# Altium schematic sheet MCU.SchDoc
size 558 x 431 mm; SheetNumber: 2; SheetTotal: 2
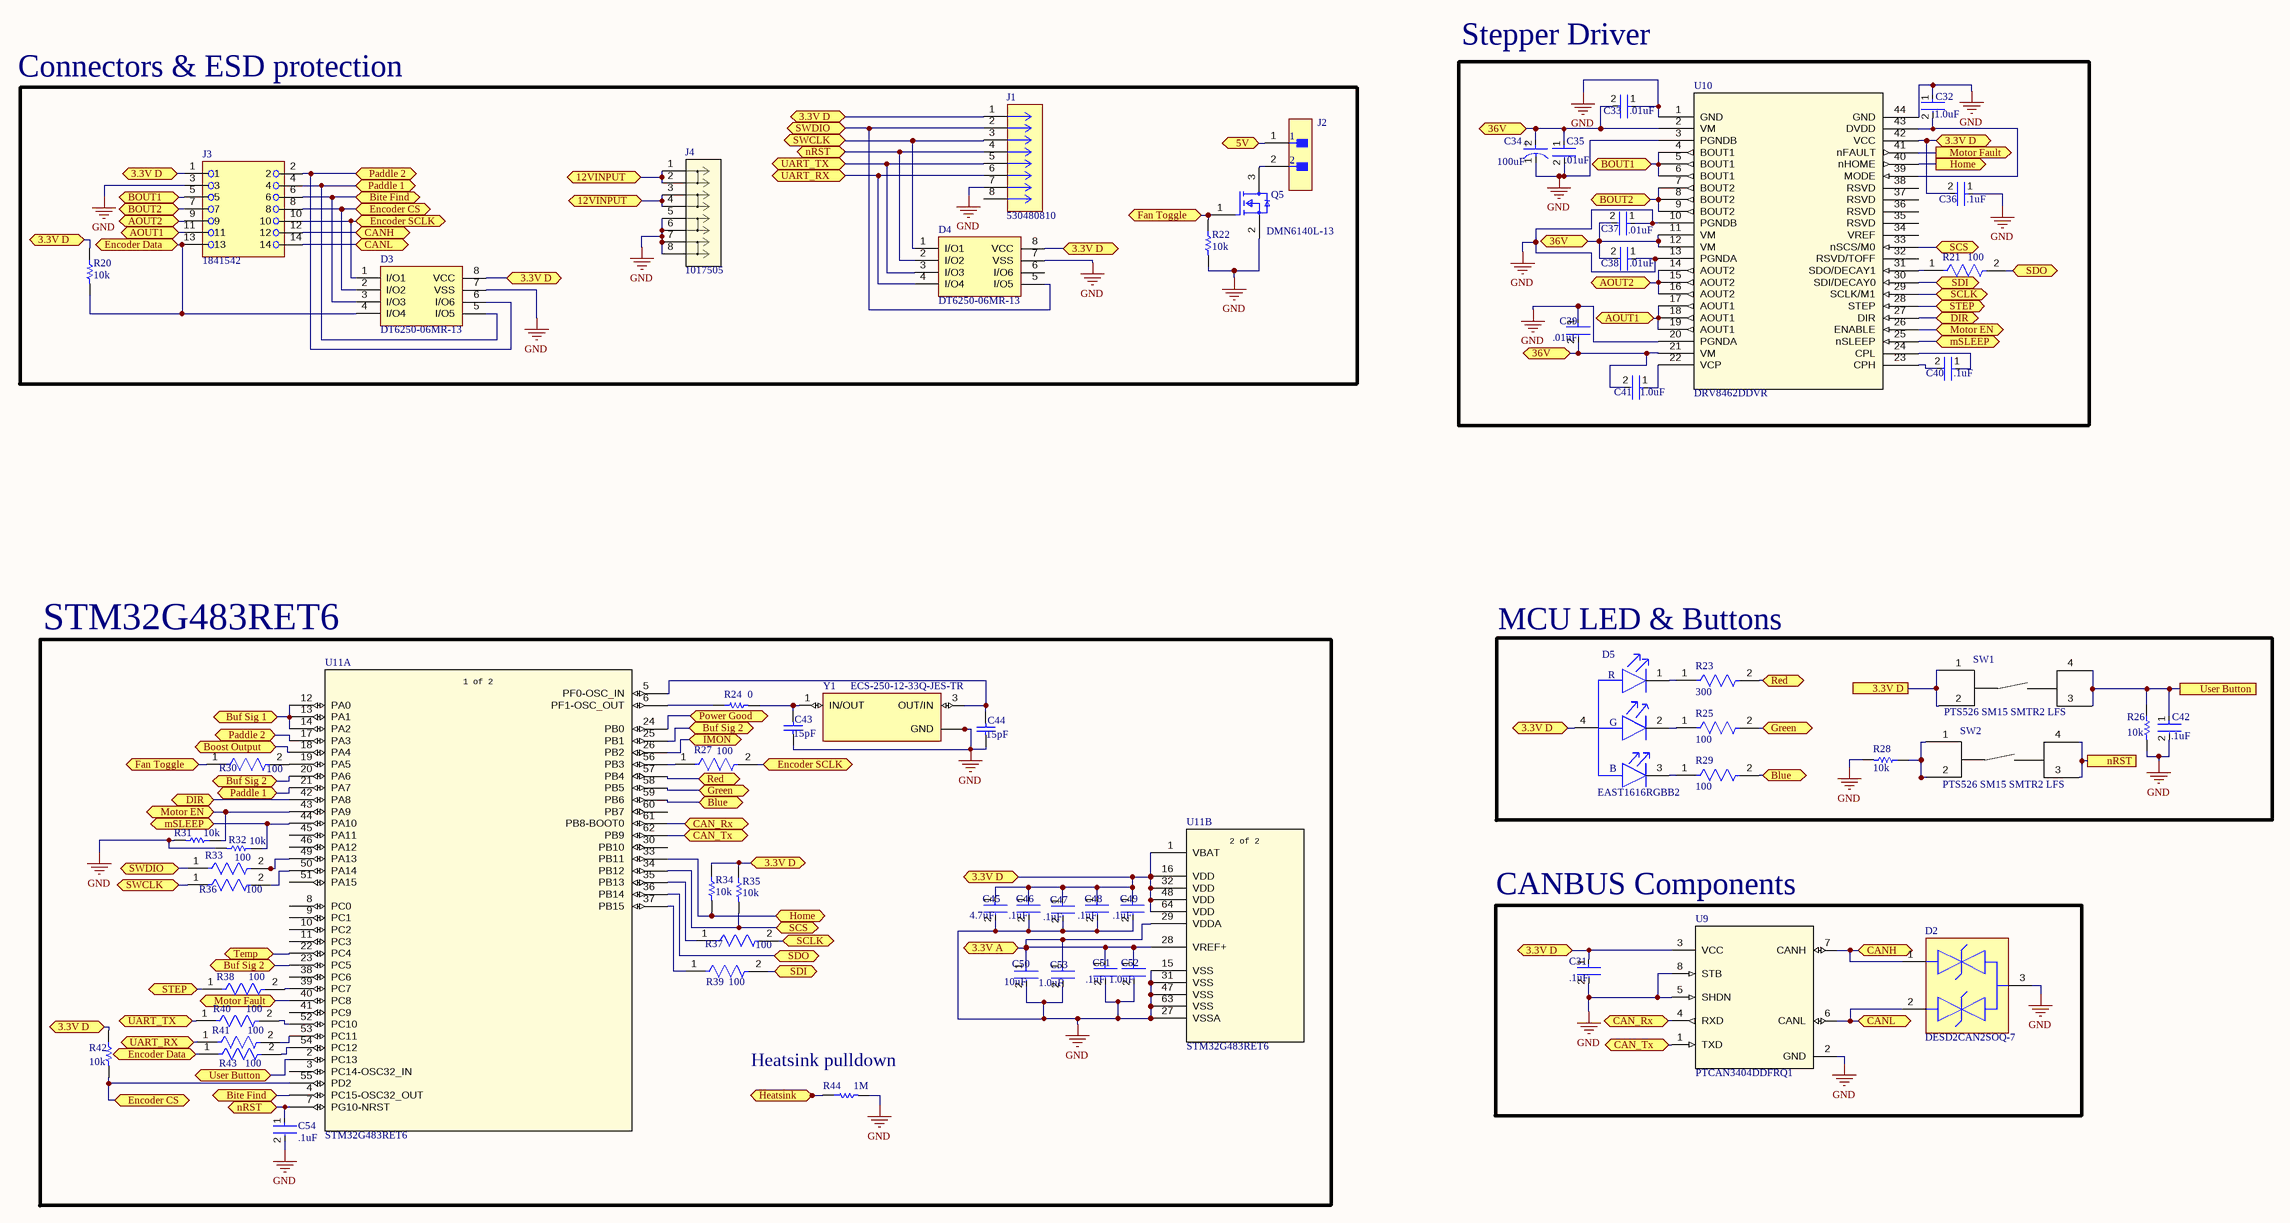
[diagram p0: MCU.SchDoc]

## Parts
C31  .1uF  [FP-GRM155-0_05-MFG]
C32  1.0uF  [FP-GRM155-0_1-MFG]
C33  .01uF  [FP-CGA2B-IPC_C]
C34  100uF  [FP-FKF-MFG]
C35  .01uF  [FP-CGA2B-IPC_C]
C36  .1uF  [FP-GRM155-0_05-MFG]
C37  .01uF  [FP-CGA2B-IPC_C]
C38  .01uF  [FP-CGA2B-IPC_C]
C39  .01uF  [FP-CGA2B-IPC_C]
C40  .1uF  [FP-GRM155-0_05-MFG]
C41  1.0uF  [FP-GRM155-0_1-MFG]
C42  .1uF  [FP-GRM155-0_05-MFG]
C43  15pF  [CAPC2013X94X50LL20T25]
C44  15pF  [CAPC2013X94X50LL20T25]
C45  4.7uF  [FP-CL829-IPC_C]
C46  .1uF  [FP-GRM155-0_05-MFG]
C47  .1uF  [FP-GRM155-0_05-MFG]
C48  .1uF  [FP-GRM155-0_05-MFG]
C49  .1uF  [FP-GRM155-0_05-MFG]
C50  10uF  [FP-CL21-IPC_A]
C51  .1uF  [FP-GRM155-0_05-MFG]
C52  1.0uF  [FP-GRM155-0_1-MFG]
C53  1.0uF  [FP-GRM155-0_1-MFG]
C54  .1uF  [FP-GRM155-0_05-MFG]
D2  DESD2CAN2SOQ-7  [FP-SOT23-MFG]
D3  DT6250-06MR-13  [SOP65P490X110-8N]
D4  DT6250-06MR-13  [SOP65P490X110-8N]
D5  EAST1616RGBB2  [FP-EAST1616RGBB2-MFG]
J1  530480810  [CONN08_530480810_MOL]
J2  B2B-ZR-3.4(LF)(SN)  [FP-B2B-ZR-3_4_LF_SN-MFG]  (value not drawn)
J3  1841542  [PHOENIX_1841542]
J4  1017505  [CONN_1017493]
Q5  DMN6140L-13  [FP-SOT23-MFG]
R20  10k  [RESC1005X40X25ML05T10]
R21  100  [FP-RT0402-MFG]
R22  10k  [RESC1005X40X25ML05T10]
R23  300  [FP-ERJ2RK-IPC_A]
R24  0  [RESC1005X40X25NL05T10]
R25  100  [FP-RT0402-MFG]
R26  10k  [RESC1005X40X25ML05T10]
R27  100  [FP-RT0402-MFG]
R28  10k  [RESC1005X40X25ML05T10]
R29  100  [FP-RT0402-MFG]
R30  100  [FP-RT0402-MFG]
R31  10k  [RESC1005X40X25ML05T10]
R32  10k  [RESC1005X40X25ML05T10]
R33  100  [FP-RT0402-MFG]
R34  10k  [RESC1005X40X25ML05T10]
R35  10k  [RESC1005X40X25ML05T10]
R36  100  [FP-RT0402-MFG]
R37  100  [FP-RT0402-MFG]
R38  100  [FP-RT0402-MFG]
R39  100  [FP-RT0402-MFG]
R40  100  [FP-RT0402-MFG]
R41  100  [FP-RT0402-MFG]
R42  10k  [RESC1005X40X25ML05T10]
R43  100  [FP-RT0402-MFG]
R44  1M  [RESC0603X26X15NL03T05]
SW1  PTS526 SM15 SMTR2 LFS  [SON4_PTS526 SM15 SMTR2 LFS_CNK]
SW2  PTS526 SM15 SMTR2 LFS  [SON4_PTS526 SM15 SMTR2 LFS_CNK]
U9  PTCAN3404DDFRQ1  [DDF0008A-IPC_A]
U10  DRV8462DDVR  [HTSSOP44_DDV_TEX]
U11  STM32G483RET6  [LQFP64-10x10mm_STM]  (parts A,B of 2)
Y1  ECS-250-12-33Q-JES-TR  [XTAL_ECS-250-12-33Q-JES-TR]

## Blocks framed on the sheet
Connectors & ESD protection: D3 D4 J1-J4 Q5 R20 R22
Stepper Driver: C32-C41 R21 U10
STM32G483RET6: C43-C54 R24 R27 R30-R44 U11 Y1
MCU LED & Buttons: C42 D5 R23 R25 R26 R28 R29 SW1 SW2
CANBUS Components: C31 D2 U9

## Ports
3.3V A (bidir, see Power_Supplies[5C]), 3.3V D (bidir, see MCU[3D], MCU[3G], MCU[4C], MCU[4D], MCU[6D], MCU[6F], MCU[7D], MCU[7G], MCU[8F], MCU[10C], MCU[10F], Power_Supplies[5C]), 3.3V D (bidir, see MCU[3D], MCU[3G], MCU[4C], MCU[4D], MCU[6D], MCU[6F], MCU[7D], MCU[7G], MCU[8F], MCU[10F], Power_Supplies[5C]), 3.3V D (bidir, see MCU[3D], MCU[3G], MCU[4C], MCU[4D], MCU[6D], MCU[6F], MCU[7D], MCU[7G], MCU[10C], MCU[10F], Power_Supplies[5C]), 3.3V D (bidir, see MCU[3D], MCU[3G], MCU[4C], MCU[4D], MCU[6D], MCU[6F], MCU[7D], MCU[8F], MCU[10C], MCU[10F], Power_Supplies[5C]), 3.3V D (bidir, see MCU[3D], MCU[3G], MCU[4C], MCU[4D], MCU[6D], MCU[6F], MCU[7G], MCU[8F], MCU[10C], MCU[10F], Power_Supplies[5C]), 3.3V D (bidir, see MCU[3D], MCU[3G], MCU[4C], MCU[4D], MCU[6D], MCU[7D], MCU[7G], MCU[8F], MCU[10C], MCU[10F], Power_Supplies[5C]), 3.3V D (bidir, see MCU[3D], MCU[3G], MCU[4C], MCU[4D], MCU[6F], MCU[7D], MCU[7G], MCU[8F], MCU[10C], MCU[10F], Power_Supplies[5C]), 3.3V D (bidir, see MCU[3D], MCU[3G], MCU[4C], MCU[6D], MCU[6F], MCU[7D], MCU[7G], MCU[8F], MCU[10C], MCU[10F], Power_Supplies[5C]), 3.3V D (bidir, see MCU[3D], MCU[3G], MCU[4D], MCU[6D], MCU[6F], MCU[7D], MCU[7G], MCU[8F], MCU[10C], MCU[10F], Power_Supplies[5C]), 3.3V D (bidir, see MCU[3D], MCU[4C], MCU[4D], MCU[6D], MCU[6F], MCU[7D], MCU[7G], MCU[8F], MCU[10C], MCU[10F], Power_Supplies[5C]), 3.3V D (see MCU[3G], MCU[4C], MCU[4D], MCU[6D], MCU[6F], MCU[7D], MCU[7G], MCU[8F], MCU[10C], MCU[10F], Power_Supplies[5C]), 5V (bidir, see Power_Supplies[4C]), 12VINPUT (bidir, see MCU[8F], Power_Supplies[2B]), 36V (bidir, see MCU[4F], MCU[4G], Power_Supplies[6D]), 36V (bidir, see MCU[4F], Power_Supplies[6D]), AOUT1 (bidir, see MCU[4F]), AOUT1 (bidir, see MCU[10F]), AOUT2 (bidir, see MCU[4F]), AOUT2 (bidir, see MCU[10F]), Bite Find (bidir, see MCU[9C]), Bite Find (bidir, see MCU[9F]), Blue (bidir, see MCU[3D]), Blue (bidir, see MCU[7D]), Boost Output (bidir, see Power_Supplies[4E]), BOUT1 (bidir, see MCU[4G]), BOUT1 (bidir, see MCU[10F]), BOUT2 (bidir, see MCU[4F]), BOUT2 (bidir, see MCU[10F]), Buf Sig 1 (bidir), Buf Sig 2 (bidir, see MCU[7D], MCU[9C]), Buf Sig 2 (bidir, see MCU[7D], MCU[9D]), Buf Sig 2 (bidir, see MCU[9C], MCU[9D]), CAN_Rx (bidir, see MCU[4C]), CAN_Rx (bidir, see MCU[7D]), CAN_Tx (bidir, see MCU[4C]), CAN_Tx (bidir, see MCU[7D]), CANH (bidir, see MCU[3C]), CANH (bidir, see MCU[9F]), CANL (bidir, see MCU[3C]), CANL (bidir, see MCU[9F]), DIR (bidir, see MCU[3F]), DIR (bidir, see MCU[9D]), Encoder CS (bidir, see MCU[9F]), Encoder CS (bidir, see MCU[10C]), Encoder Data (bidir, see MCU[10C]), Encoder Data (bidir, see MCU[10F]), Encoder SCLK (bidir, see MCU[7D]), Encoder SCLK (bidir, see MCU[9F]), Fan Toggle (bidir, see MCU[6F]), Fan Toggle (bidir, see MCU[10D]), Green (bidir, see MCU[3D]), Green (bidir, see MCU[7D]), Heatsink (bidir), Home (bidir, see MCU[3G]), Home (out, see MCU[7D]), IMON (bidir, see Power_Supplies[6B]), Motor EN (bidir, see MCU[3F]), Motor EN (bidir, see MCU[9D]), Motor Fault (bidir, see MCU[3G]), Motor Fault (out, see MCU[9C]), mSLEEP (bidir, see MCU[3F]), mSLEEP (bidir, see MCU[9D]), nRST (bidir, see MCU[2D], MCU[7G]), nRST (bidir, see MCU[2D], MCU[9C]), nRST (see MCU[7G], MCU[9C]), Paddle 1 (bidir, see MCU[9D]), Paddle 1 (bidir, see MCU[9F]), Paddle 2 (bidir, see MCU[9D]), Paddle 2 (bidir, see MCU[9F]), Power Good (bidir, see Power_Supplies[4D]), Red (bidir, see MCU[3D]), Red (bidir, see MCU[7D]), SCLK (bidir, see MCU[3F]), SCLK (bidir, see MCU[7C]), SCS (bidir, see MCU[3F]), SCS (bidir, see MCU[7C]), SDI (bidir, see MCU[3F]), SDI (bidir, see MCU[7C]), SDO (bidir, see MCU[2F]), SDO (bidir, see MCU[7C]), STEP (bidir, see MCU[3F]), STEP (bidir, see MCU[9C]), SWCLK (bidir, see MCU[7G]), SWCLK (bidir, see MCU[10D]), SWDIO (bidir, see MCU[7G]), SWDIO (bidir, see MCU[10D]), Temp (bidir, see Power_Supplies[4B]), UART_RX (bidir, see MCU[7F]), UART_RX (bidir, see MCU[10C]), UART_TX (bidir, see MCU[7G]), UART_TX (bidir, see MCU[10C]), User Button (bidir, see MCU[2D]), User Button (see MCU[9C])

## Nets
GND: C31.2 C32.1 C33.1 C34.1(C) C35.2 C36.1 C37.1 C38.1 C39.1 C42.2 C43.2 C44.2 C45.2 C46.2 C47.2 C48.2 C49.2 C50.2 C51.2 C52.2 C53.2 C54.2 D2.3 D3.7(VSS) D4.7(VSS) J1.7 J3.3 J4.5 J4.6 J4.7 J4.8 Q5.2(S) R22.2 R26.2 R28.2 R31.2 R32.2 R44.2 U9.2(GND) U9.5(SHDN) U9.8(STB) U10.1(GND) U10.3(PGNDB) U10.10(PGNDB) U10.13(PGNDA) U10.20(PGNDA) U10.44(GND) U11.15(VSS) U11.27(VSSA) U11.31(VSS) U11.47(VSS) U11.63(VSS) Y1.2(GND) Y1.4(GND)
3.3V A: C50.1 C51.1 C52.1 C53.1 U11.28(VREF+) U11.29(VDDA) ; port 3.3V A
3.3V D: C31.1 C36.2 C45.1 C46.1 C47.1 C48.1 C49.1 D3.8(VCC) D4.8(VCC) D5.4(Common_Anode) J1.1 J3.1 R20.1 R34.1 R35.1 R42.1 SW1.1 SW1.2 U9.3(VCC) U10.42(VCC) U11.1(VBAT) U11.16(VDD) U11.32(VDD) U11.48(VDD) U11.64(VDD) ; port 3.3V D
5V: J2.1 ; port 5V
12VINPUT: J4.1 J4.2 J4.3 J4.4 ; port 12VINPUT
36V: C33.2 C34.2(A) C35.1 C37.2 C38.2 C39.2 C41.2 U10.2(VM) U10.11(VM) U10.12(VM) U10.21(VM) ; port 36V
AOUT1: J3.11 U10.17(AOUT1) U10.18(AOUT1) U10.19(AOUT1) ; port AOUT1
AOUT2: J3.9 U10.14(AOUT2) U10.15(AOUT2) U10.16(AOUT2) ; port AOUT2
Bite Find: D3.3(I/O3) J3.6 U11.4(PC15-OSC32_OUT) ; port Bite Find
Blue: R29.2 U11.59(PB6) ; port Blue
Boost Output: U11.18(PA4) ; port Boost Output
BOUT1: J3.5 U10.4(BOUT1) U10.5(BOUT1) U10.6(BOUT1) ; port BOUT1
BOUT2: J3.7 U10.7(BOUT2) U10.8(BOUT2) U10.9(BOUT2) ; port BOUT2
Buf Sig 1: U11.12(PA0) U11.13(PA1) U11.14(PA2) ; port Buf Sig 1
Buf Sig 2: U11.20(PA6) U11.23(PC5) U11.25(PB1) ; port Buf Sig 2
CAN_Rx: U9.4(RXD) U11.61(PB8-BOOT0) ; port CAN_Rx
CAN_Tx: U9.1(TXD) U11.62(PB9) ; port CAN_Tx
CANH: D2.1 J3.12 U9.7(CANH) ; port CANH
CANL: D2.2 J3.14 U9.6(CANL) ; port CANL
DIR: U10.27(DIR) U11.42(PA8) ; port DIR
Encoder CS: D3.2(I/O2) J3.8 R42.2 U11.55(PD2) ; port Encoder CS
Encoder Data: D3.4(I/O4) J3.13 R20.2 R43.1 ; port Encoder Data
Encoder SCLK: D3.1(I/O1) J3.10 R27.2 ; port Encoder SCLK
Fan Toggle: Q5.1(G) R22.1 R30.1 ; port Fan Toggle
Green: R25.2 U11.58(PB5) ; port Green
Heatsink: R44.1 ; port Heatsink
Home: R34.2 U10.40(nHOME) U11.33(PB11) ; port Home
IMON: U11.26(PB2) ; port IMON
Motor EN: R31.1 U10.26(ENABLE) U11.43(PA9) ; port Motor EN
Motor Fault: U10.41(nFAULT) U11.40(PC8) ; port Motor Fault
mSLEEP: R32.1 U10.25(nSLEEP) U11.44(PA10) ; port mSLEEP
nRST: C54.1 D4.2(I/O2) J1.4 SW2.3 SW2.4 U11.7(PG10-NRST) ; port nRST
Paddle 1: D3.5(I/O5) J3.4 U11.21(PA7) ; port Paddle 1
Paddle 2: D3.6(I/O6) J3.2 U11.17(PA3) ; port Paddle 2
Power Good: U11.24(PB0) ; port Power Good
Red: R23.2 U11.57(PB4) ; port Red
SCLK: R37.2 U10.29(SCLK/M1) ; port SCLK
SCS: R35.2 U10.33(nSCS/M0) U11.34(PB12) ; port SCS
SDI: R39.2 U10.30(SDI/DECAY0) ; port SDI
SDO: R21.2 U11.36(PB14) ; port SDO
STEP: R38.1 U10.28(STEP) ; port STEP
SWCLK: D4.1(I/O1) J1.3 R36.1 ; port SWCLK
SWDIO: D4.5(I/O5) J1.2 R33.1 ; port SWDIO
Temp: U11.22(PC4) ; port Temp
UART_RX: D4.4(I/O4) J1.6 R41.1 ; port UART_RX
UART_TX: D4.3(I/O3) J1.5 R40.1 ; port UART_TX
User Button: C42.1 R26.1 SW1.3 SW1.4 U11.2(PC13) ; port User Button
NetC32_2: C32.2 U10.39(MODE) U10.43(DVDD)
NetC40_1: C40.1 U10.24(CPL)
NetC40_2: C40.2 U10.23(CPH)
NetC41_1: C41.1 U10.22(VCP)
NetC43_1: C43.1 R24.2 Y1.1(IN/OUT)
NetC44_1: C44.1 U11.5(PF0-OSC_IN) Y1.3(OUT/IN)
NetD5_1: D5.1(Red_C) R23.1
NetD5_2: D5.2(Green_C) R25.1
NetD5_3: D5.3(Blue_C) R29.1
NetJ2_2: J2.2 Q5.3(D)
NetR21_1: R21.1 U10.31(SDO/DECAY1)
NetR24_1: R24.1 U11.6(PF1-OSC_OUT)
NetR27_1: R27.1 U11.56(PB3)
NetR28_1: R28.1 SW2.1 SW2.2
NetR30_2: R30.2 U11.19(PA5)
NetR33_2: R33.2 U11.49(PA13)
NetR36_2: R36.2 U11.50(PA14)
NetR37_1: R37.1 U11.35(PB13)
NetR38_2: R38.2 U11.39(PC7)
NetR39_1: R39.1 U11.37(PB15)
NetR40_2: R40.2 U11.52(PC10)
NetR41_2: R41.2 U11.53(PC11)
NetR43_2: R43.2 U11.54(PC12)

Not connected (* = marked no-connect by the designer): D4 6(I/O6); J1 8; U10 32(RSVD/TOFF) 34(VREF) 35(RSVD) 36(RSVD) 37(RSVD) 38(RSVD); U11 3(PC14-OSC32_IN) 8(PC0) 9(PC1) 10(PC2) 11(PC3) 30(PB10) 38(PC6) 41(PC9) 45(PA11) 46(PA12) 51(PA15) 60(PB7)

## Notes on the sheet
- (near R44) Heatsink pulldown
- DWG. NO.
- REV.
- SHT.
- REVISION
- DESCRIPTION
- DATE
- APPROVED
- THIS DOCUMENT AND THE DATA DISCLOSED HEREIN OR HEREWITH IS THE PROPERTY OF ALTIUM LIMITED AND MAY BE FREELY DISTRIBUTED IN WHOLE. NO RIGHTS ARE RESERVED OR EXPRESS OR IMPLIED WARANTEE GIVEN.
- ENG:
- DSN:
- APPROVALS
- PROJECT
- DOCUMENT REVISION:
- DESIGN ITEM:
- CHK:
- BOM:
- REFERENCE DOCUMENTS
- PROJECT REVISION:
- TITLE
- FAB DWG:
- PCB DWG:
- ASSY DWG:
- SCALE:
- SIZE
- C
- CAGE CODE
- FILE NAME
- DWG NO.
- SHEET
- OF
- REV
- (in symbol CMP-031-00013-2, part A) 1 of 2
- (in symbol CMP-031-00013-2, part B) 2 of 2
- (in symbol CMP-2000-06208-3) +
- (in symbol CMP-51564-000002-1) R; G; B

## Library data of the parts
C31 C36 C40 C42 C46-C49 C51 C54 = CMP-06035-023139-1: Chip Multilayer Ceramic Capacitors for General Purpose, 0402, 0.10uF, B, 10%, 10%, 50V; Capacitance: 100nF; Value: 100nF; Length: 1mm; Width: 500um; Voltage Rating (DC): 50V; Lead Free: Lead Free; Tolerance: 10%; Thickness: 500um
C32 C41 C52 C53 = CMP-06035-041084-1: Chip Multilayer Ceramic Capacitors for General Purpose, 0402, 1.0uF, X5R, 15%, 10%, 50V
C33 C35 C37-C39 = CMP-08246-000752-1: Cap Ceramic 10nF 50V X7R 20% Pad SMD 0402 +125°C Automotive T/R; Voltage Rating (DC): 50V; Dielectric: X7R; Length: 0.039inch; Weight: 2.3E-05oz; Mount: Surface Mount; Thickness: 0.022inch; Height: 0.5mm; Voltage Rating: 50V; Max Operating Temperature: 125°C; Case Code (Imperial): 0402; Capacitance: 10nF; Min Operating Temperature: -55°C; Case Code (Metric): 1005; Case/Package: 0402; Tolerance: 20%; Package Quantity: 10000; Width: 0.02inch; Packaging: Tape and Reel; Ratings: AEC-Q200; Value: 10nF
C34 = CMP-2000-06208-3: Radial Can - SMD ALUMINUM ELECTROLYTIC CAPACITOR FK 50V 100muF ±20% 0.315Dia 8.00mm; Leakage Current: 3uA; ESR (Equivalent Series Resistance): 340mR; Material: Aluminium; Ripple Current: 350mA; Life (Hours): 2000Hour; Min Operating Temperature: -55°C; Contact Plating: Tin; REACH SVHC: No SVHC; RoHS Compliant: Yes; Width: 10mm; Radiation Hardening: No; Termination: SMD/SMT; Packaging: Tape and Reel; Max Operating Temperature: 105°C; Case/Package: Radial; Voltage Rating: 50V; Length: 10.2mm; Voltage: 50V; Package Quantity: 1; Voltage Rating (DC): 50V; Height - Seated (Max): 0.402inch; Mount: Surface Mount; Impedance: 340mR; Construction: Cylindrical; Height: 10.2mm; Lead Free: Lead Free; Dielectric Material: Aluminium; Series: FK; Tolerance: 20%; Diameter: 8mm; Ripple Current (AC): 350mA; Capacitance: 100uF; Number of Pins: 2; Value: 100uF
C43 C44 = CMP-2007-04490-1: Cap Ceramic 15pF 50V C0G 1% SMD 0805 125°C Paper T/R; Part Number: 08055A150FAT2A; Manufacturer: AVX Interconnect / Elco
C45 = CMP-13271-001468-1: Cap Ceramic 4.7uF 16V X5R ±20% SMD 0402 +85°C Paper T/R; Mount: Surface Mount; Case Code (Metric): 1005; Case/Package: 0402; Length: 0.039inch; Capacitance: 4.7uF; Voltage Rating: 16V; Max Operating Temperature: 85°C; Tolerance: 20%; Thickness: 0.022inch; Min Operating Temperature: -55°C; Case Code (Imperial): 0402; Packaging: Tape and Reel; Width: 0.02inch; Value: 4.7uF
C50 = CMP-13271-002975-1: CL21 Series 0805 10uF 25V ±10% Tolerance X5R Multilayer Ceramic Chip Capacitor; Case Code (Imperial): 0805; Length: 2mm; Case/Package: 0805; Packaging: Tape and Reel; Width: 0.049inch; Tolerance: 10%; Mount: Surface Mount; Min Operating Temperature: -55°C; Thickness: 0.057inch; Height: 1.25mm; Dielectric: X5R; Package Quantity: 1; Depth: 1.25mm; Capacitance: 10uF; Voltage Rating: 25V; Case Code (Metric): 2012; Max Operating Temperature: 85°C; Radiation Hardening: No; Value: 10uF
D2 = CMP-12828-000016-1: TVS DIODE 24V 41V SOT23; Manufacturer: Diodes Inc.; Peak Pulse Current: 5A; Automotive Grade: Grade 0; Value: 25pF; Number Of Channels: 2; Direction: Bidirectional; Max Junction Temp: +150°C; Breakdown Voltage: 25.4V; Peak Pulse Power: 230W; Standoff Height: 0.013mm; ComponentLink2Description: Datasheet; Temperature Range High: +150°C; Device Class L2: TVS Diodes; Octopart: https://octopart.com/desd2can2soq-7-diodes+inc.-53081564; Device Class L3: unset; RoHS: TRUE; ComponentLink2URL: https://www.diodes.com/assets/Datasheets/DESD2CAN2SOQ.pdf; Height: 1.1mm; Digikey Description: TVS DIODE 24V 41V SOT23; Footprint Url: https://www.diodes.com/assets/Package-Files/SOT23.pdf; Manufacturer Part Number: DESD2CAN2SOQ-7; Package: SOT23; Temperature: -65°C to +150°C; Mouser Description: ESD Suppressors / TVS Diodes Dual CAN Bus ESD 25pF 24V 25.4V; Capacitance: 25pF; Category: Diode; Clamping Voltage: 41V; Lead Free: Yes; Reverse Standoff Voltage: 24V; Device Class L1: Circuit Protection; Temperature Range Low: -65°C; Automotive: Yes
D3 D4 = CMP-004-00033-2: ESD Suppressors / TVS Diodes TVS Low Cap ESD 0.32pF 5V 4A 10Vc; Manufacturer_Name: Diodes Incorporated; Geometry.Height: 1.1mm; Source: DT6250-06MR-13.SchLib; Mouser Price/Stock: https://www.mouser.co.uk/ProductDetail/Diodes-Incorporated/DT6250-06MR-13?qs=wtVJq%252Be05r%252BwT706hxu0BA%3D%3D; Mouser Part Number: 621-DT6250-06MR-13; Datasheet Link: https://www.diodes.com//assets/Datasheets/DT6250-06MR.pdf; Manufacturer_Part_Number: DT6250-06MR-13; Design Item ID: DT6250-06MR-13
D5 = CMP-51564-000002-1: LED RGB DIFFUSED 4SMD; Manufacturer: Everlight; Viewing Angle: 120°; Power Dissipation: 95/95/60mW; Luminous Intensity: 36/140/45mcd; Colour: Blue, Green, Red; Peak Emmision Wavelength: 468/518/632nm; Forward Current: 5mA; Reverse Voltage: 5V; Led Orientation: Top View; Forward Voltage: 3/3/2.1V; Wavelength: 475/535/628nm; Temperature: -40°C to +85°C; Temperature Range Low: -40°C; ComponentLink2URL: https://everlightamericas.com/index.php?controller=attachment&id_attachment=2426; ComponentLink2Description: Datasheet; Category: Diode; Digikey Description: LED RGB DIFFUSED 4SMD; Automotive: No; RoHS: TRUE; Manufacturer Part Number: EAST1616RGBB2; Device Class L2: LEDs; Device Class L1: Optoelectronics; Octopart: https://octopart.com/east1616rgbb2-everlight-80328051; Device Class L3: unset; Package: 0; Temperature Range High: +85°C; Lead Free: Yes; Height: 0.45mm
J1 = CMP-002-00077-2: Conn Shrouded Header (4 Sides) HDR 8 POS 1.25mm Solder RA Thru-Hole PicoBladeâ„¢ Tray; MF: Molex; Case/Package: None; Pins: 8; Check_prices: https://www.snapeda.com/parts/530480810/Molex/view-part/?ref=eda; SnapEDA_Link: https://www.snapeda.com/parts/530480810/Molex/view-part/?ref=snap; MP: 530480810; Source: 530480810.SchLib; Design Item ID: 530480810; Value: *; Component Type: Standard
J2 = CMP-17439-000601-1: CONN HEADER VERT 2POS 1.5MM; Mated Stacking Heights: 5.6mm; Voltage Rating: 50V; Number of Positions: 2; Termination: Press-Fit; Insulation Color: Natural; Pitch: 1.5mm; Number of Rows: 1; Fastening Type: Detent; Insulation Material: Nylon; Contact Shape: Circular; Lead Free: Lead Free; Series: ZH; Connector Type: Header; Contact Type: Male Pin; Packaging: Bulk; Contact Finish - Mating: TIN; Mount: Through Hole; Contact Material: Brass; Flammability Rating: UL94 V-0
J3 = CMP-076-000000-2: PCB Terminal Push-In 3.5mm 16AWG 200V 10A 7 Position Combicon Control Series; MF: Phoenix Contact; Check_prices: https://www.snapeda.com/parts/1841542/Phoenix+Contact/view-part/?ref=eda; MP: 1841542; Design Item ID: 1841542; Value: *; Package: None; Component Type: Standard; Source: 1841542.SchLib; SnapEDA_Link: https://www.snapeda.com/parts/1841542/Phoenix+Contact/view-part/?ref=snap; Pin Count: 14
J4 = CMP-069-000000-2: PCB terminal block, nominal current: 32 A, nom. voltage: 400 V, pitch: 5.08 mm, number of positions: 4, connection method: Push-in spring connection, mounting: Wave soldering, conductor/PCB connection direction: 0 Â°, color: green; Manufacturer_Name: Phoenix Contact; Type: Type; Design Item ID: 1017505; RefDes: RefDes; Copyright: Copyright (C) 2025 Ultra Librarian. All rights reserved.; Manufacturer_Part_Number: 1017505; Source: 1017505.SchLib
Q5 = CMP-12801-000047-1: MOSFET N-CH 60V 1.6A SOT23; Manufacturer: Diodes Inc.; Turn Off Delay Time: 16.3ns; Power Dissipation: 0.7W; Pulse Drain Current: 10A; Number Of Channels: 1; Reverse Recovery Time: 16.8ns; Typ Forward Diode Voltage: 0.75V; Gate To Source Voltage: 20V; Rthja Max: 183°C/W; Gate Charge At Vgs: 8.6nC @ 10V; Drain To Source Resistance: 92mΩ; Depletion Mode: False; Max Junction Temp: +150°C; Max Forward Diode Voltage: 1V; Reverse Recovery Charge: 9nC; Input Capacitace At Vds: 315pF @ 40V; Standoff Height: 0.013mm; Threshold Vgs Max: 3V; Turn On Delay Time: 2.6ns; Mouser Description: MOSFET 31V to 99V N-Ch FET 60Vds 20Vgs 2.3A; ComponentLink2Description: Datasheet; Digikey Description: MOSFET N-CH 60V 1.6A SOT23; Lead Free: Yes; Category: Trans; Device Class L3: MOSFETs; Temperature Range High: +150°C; Octopart: https://octopart.com/dmn6140l-13-diodes+inc.-38898616; Drain To Source Voltage: 60V; ComponentLink2URL: https://www.diodes.com/assets/Datasheets/DMN6140L.pdf; Drain To Source Breakdown Voltage: 60V; Footprint Url: https://www.diodes.com/assets/Package-Files/SOT23.pdf; Package: SOT23; Continuous Drain Current: 1.6A; Device Class L1: Discrete Semiconductors; Device Class L2: Transistors; Number Of N Channels: 1; Temperature Range Low: -55°C; Height: 1.1mm; Manufacturer Part Number: DMN6140L-13; RoHS: TRUE; Temperature: -55°C to +150°C; Threshold Vgs Min: 1V; Automotive: No
R20 R22 R26 R28 R31 R32 R34 R35 R42 = CMP-2002-03043-1: Part Number: CRCW040210K0FKEDHP; Manufacturer: Vishay Dale
R21 R25 R27 R29 R30 R33 R36-R41 R43 = CMP-03412-024637-1: RES SMD 100 OHM 0.1% 1/16W 0402; Manufacturer Part Number: RT0402BRE07100RL; Manufacturer: Yageo; Resistance: 100Ω; Voltage Rating: 50V; Power Rating: 0.063W; Tolerance: 0.001; Temperature Coefficient: 50 ppm/°C; Value: 100Ω; ComponentLink2Description: Datasheet; Height: 0.35mm; Temperature: -55°C to +155°C; Lead Free: Yes; Device Class L2: Resistors; Device Class L1: Passive Components; Automotive: No; Device Class L3: Chip SMD Resistors; Digikey Description: RES SMD 100 OHM 0.1% 1/16W 0402; RoHS: TRUE; Temperature Range Low: -55°C; ComponentLink2URL: http://www.yageo.com/documents/recent/PYu-RT_1-to-0.01_RoHS_L_9.pdf; Series: RT; Ipc Land Pattern Name: RESC10050X30; Category: Res; Package: RT0402; Octopart: https://octopart.com/rt0402bre07100rl-yageo-1420018; Temperature Range High: +155°C; Mouser Description: Thin Film Resistors - SMD; Footprint Url: http://www.yageo.com/exep/pages/download/literatures/PYu-R_Mount_10.pdf; Composition: Thin Film
R23 = CMP-1011-00449-3: RES SMD 300 OHM 1% 1/10W 0402; Power Rating: 100mW; Voltage Rating: 50V; Temperature Coefficient: 100ppm/°C; Resistance: 300R; Value: 300R; Case Code (Imperial): 0402; Termination: SMD/SMT; REACH SVHC: No SVHC; Number of Terminations: 2; Composition: Thick Film; Case Code (Metric): 1005; Voltage Rating (DC): 50V; Packaging: Tape and Reel; Max Power Dissipation: 100mW; Tolerance: 1%; Lead Free: Lead Free; Military Standard: Not; Mount: Surface Mount; Height: 0.35mm; Package Quantity: 10000; Max Operating Temperature: 155°C; Depth: 0.5mm; Min Operating Temperature: -55°C; Length: 1mm; Contact Plating: Tin; Width: 0.02inch; Case/Package: 0402
R24 = CMP-1011-00001-2: Manufacturer: Yageo / Phycomp; Part Number: RC0402JR-070RL
R44 = CMP-2004-02580-1: Part Number: MCRE000212; Manufacturer: Multicomp
SW1 SW2 = CMP-011-00013-2: Description; Manufacturer_Name: C&K Components; Type: Type; Manufacturer_Part_Number: PTS526 SM15 SMTR2 LFS; Design Item ID: PTS526 SM15 SMTR2 LFS; Source: PTS526SM15SMTR2LFS.SchLib; Copyright: Copyright (C) 2025 Ultra Librarian. All rights reserved.; RefDes: RefDes
U9 = CMP-079-000000-2: Automotive 3.3V CAN flexible-data-rate (FD) transceiver with shutdown and standby mode 8-SOT-23-THIN -40 to 150; Manufacturer_Name: Texas Instruments; Copyright: Copyright (C) 2025 Ultra Librarian. All rights reserved.; TYPE: TYPE; Design Item ID: PTCAN3404DDFRQ1; Source: PTCAN3404DDFRQ1.SchLib; RefDes: RefDes; Manufacturer_Part_Number: PTCAN3404DDFRQ1
U10 = CMP-039-000000-3: 65V, 10A dual H-bridge stepper motor driver with smart tune, stall detect and auto torque 44-HTSSOP -40 to 125; Manufacturer_Name: Texas Instruments; Source: DRV8462DDVR.SchLib; RefDes: RefDes; Design Item ID: DRV8462DDVR; Manufacturer_Part_Number: DRV8462DDVR; Copyright: Copyright (C) 2025 Ultra Librarian. All rights reserved.; Type: Type
U11 = CMP-031-00013-2: Mainstream Arm Cortex-M4+ MCU 170 MHz with 512 Kbytes of Flash memory, Math Accelerator,  High Analog level integration; Manufacturer_Name: STMicroelectronics; Manufacturer_Part_Number: STM32G483RET6; Type: Type; Copyright: Copyright (C) 2025 Ultra Librarian. All rights reserved.; Design Item ID: STM32G483RET6; Source: STM32G483RET6.SchLib; RefDes: RefDes
Y1 = CMP-003-00030-1: 25 MHz Â±20ppm Crystal 12pF 40 Ohms 4-SMD, No Lead; MF: ECS Inc.; MP: ECS-250-12-33Q-JES-TR; Value: *; Pins: 4; Source: ECS-250-12-33Q-JES-TR.SchLib; Design Item ID: ECS-250-12-33Q-JES-TR; SnapEDA_Link: https://www.snapeda.com/parts/ECS-250-12-33Q-JES-TR/ECS/view-part/?ref=snap; Check_prices: https://www.snapeda.com/parts/ECS-250-12-33Q-JES-TR/ECS/view-part/?ref=eda; Component Type: Standard; Case/Package: ECX-33Q-33Q-4 ECS